# Altium schematic sheet Camera.SchDoc
size B
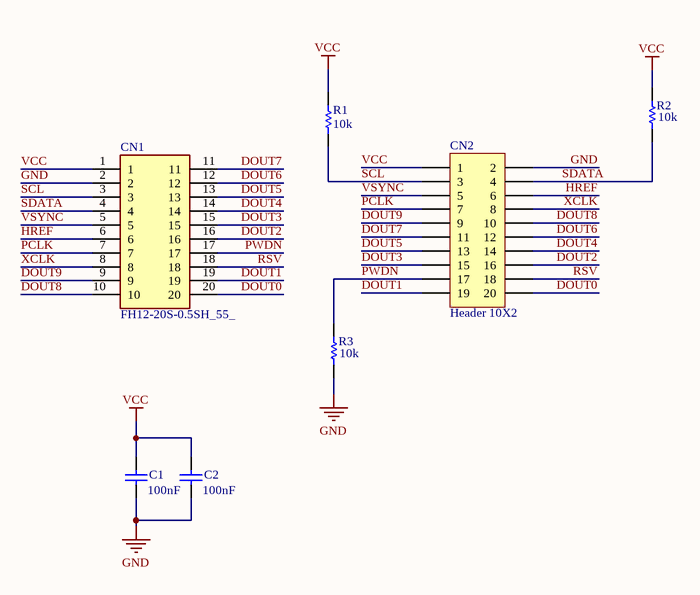
[diagram p0: Camera.SchDoc]

## Parts
C1  value 100nF  [1608[0603]]  (hidden comment: X5R)
C2  value 100nF  [1608[0603]]  (hidden comment: X5R)
CN1  FH12-20S-0.5SH_55_  [FH12-20S-0.5SH(55)]
CN2  Header 10X2  [HDR2X10]
R1  value 10k  [1608[0603]]  (hidden comment: Res1)
R2  value 10k  [1608[0603]]  (hidden comment: Res1)
R3  value 10k  [1608[0603]]  (hidden comment: Res1)

## Nets
GND: C1.2 C2.2 CN1.2 CN2.2 R3.2
VCC: C1.1 C2.1 CN1.1 CN2.1 R1.1 R2.1
DOUT0: CN1.20 CN2.20
DOUT1: CN1.19 CN2.19
DOUT2: CN1.16 CN2.16
DOUT3: CN1.15 CN2.15
DOUT4: CN1.14 CN2.14
DOUT5: CN1.13 CN2.13
DOUT6: CN1.12 CN2.12
DOUT7: CN1.11 CN2.11
DOUT8: CN1.10 CN2.10
DOUT9: CN1.9 CN2.9
HREF: CN1.6 CN2.6
PCLK: CN1.7 CN2.7
PWDN: CN1.17 CN2.17 R3.1
RSV: CN1.18 CN2.18
SCL: CN1.3 CN2.3 R1.2
SDATA: CN1.4 CN2.4 R2.2
VSYNC: CN1.5 CN2.5
XCLK: CN1.8 CN2.8

## Library data of the parts
C1 C2 = Cap: Capacitor; Published: 8-Jun-2000; LatestRevisionDate: 17-Jul-2002; LatestRevisionNote: Re-released for DXP Platform.; PackageReference: RAD-0.3; Publisher: Altium Limited; PackageDescription: Radial Cap, Thru-Hole; 2 Leads; 0.3 in Pin Spacing
CN1 = FH12-20S-0.5SH_55_: Connector; Manufacturer_Name: Hirose; Datasheet Link: https://componentsearchengine.com/Datasheets/2/FH12-20S-0.5SH(55).pdf; Manufacturer_Part_Number: FH12-20S-0.5SH(55); Mouser Part Number: 798-FH12-20S-0.5SH55; Mouser Price/Stock: https://www.mouser.co.uk/ProductDetail/Hirose-Connector/FH12-20S-0.5SH55?qs=Ux3WWAnHpjBAoMH%252Bjl1N9Q%3D%3D
CN2 = Header 10X2: Header, 10-Pin, Dual row; LatestRevisionDate: 17-Jul-2002; LatestRevisionNote: Re-released for DXP Platform.; Publisher: Altium Limited
R1-R3 = Res1: Resistor; Published: 8-Jun-2000; LatestRevisionDate: 17-Jul-2002; LatestRevisionNote: Re-released for DXP Platform.; PackageReference: AXIAL-0.3; Publisher: Altium Limited; PackageDescription: Axial Device, Thru-Hole; 2 Leads; 0.3 in Pin Spacing